# EAGLE schematic main (EAGLE 6.6.0)
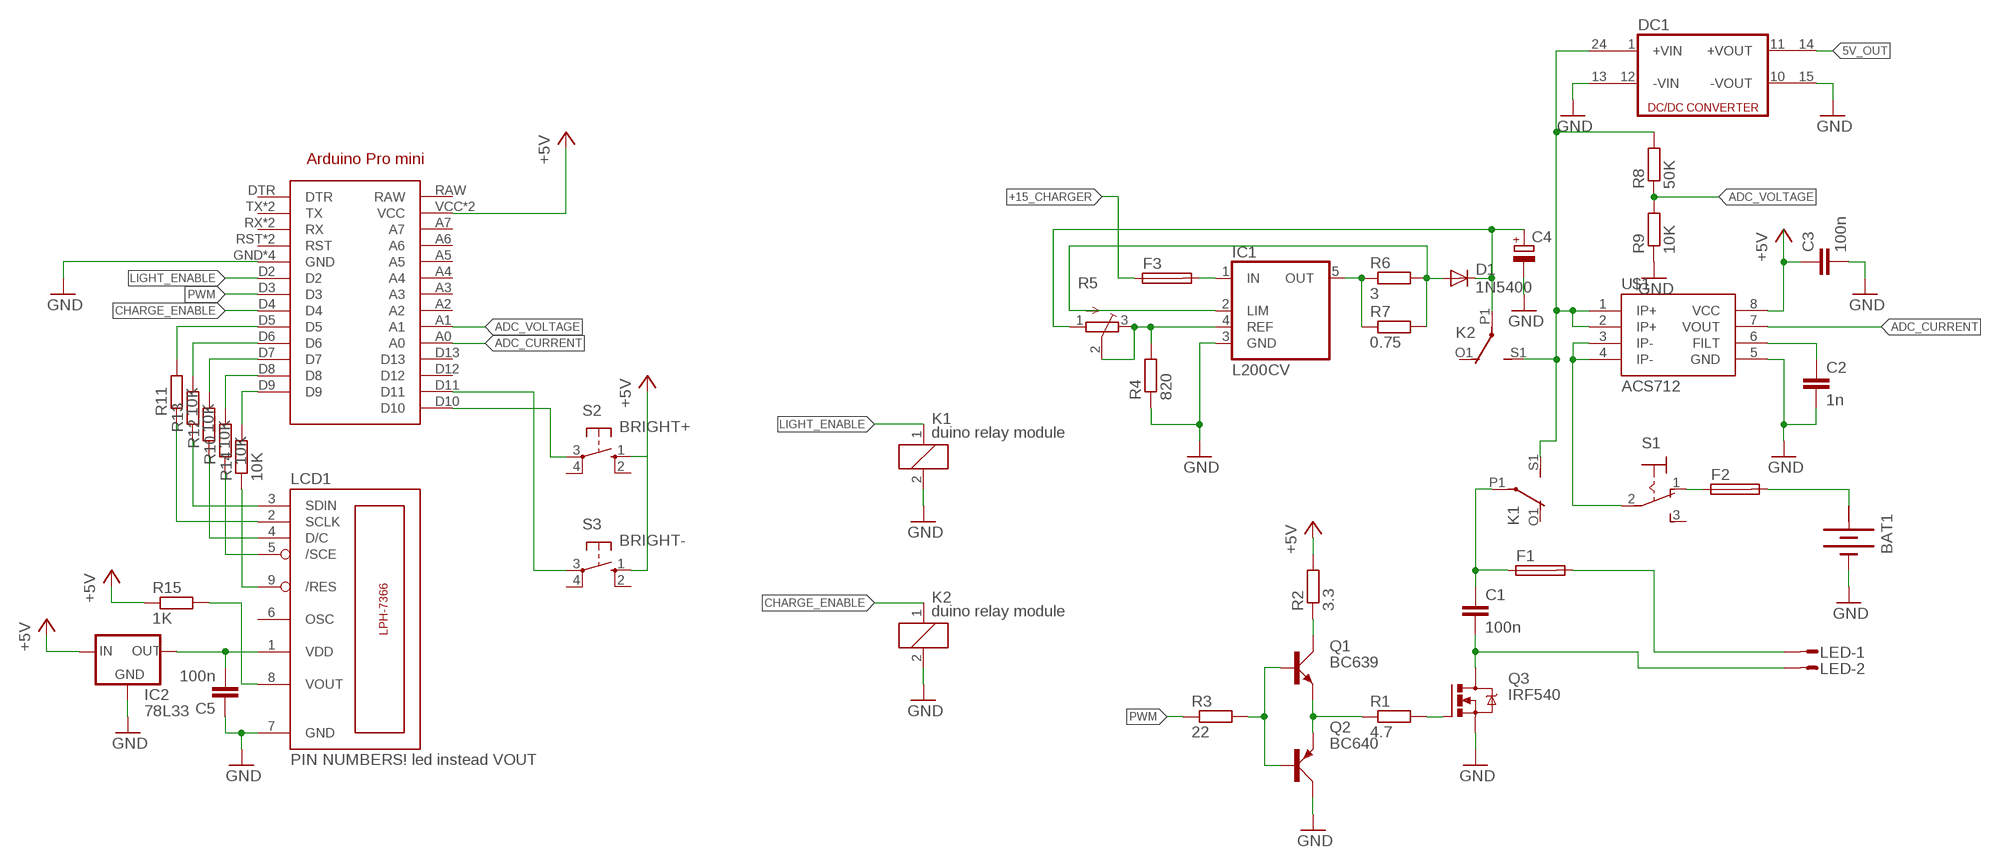
[diagram p0: schematic, sheet 1]

## Parts
ARDUINO1  ARDUINO_PRO_MINI  [ARDUINO_PRO_MINI]
BAT1  BATTERY  [BATTERY]
C1  100n  C2,5-3  [C2.5-3]
C2  1n  C2,5-3  [C2.5-3]
C3  100n  C2,5-3  [C2.5-3]
C4  CPOL-EUE1.8-4  [E1,8-4]
C5  100n  C2,5-3  [C2.5-3]
D1  1N5400  [DO201-15]
DC1  DC213R  [CMK]
F1  FUSESH22,5  [SH22,5]
F2  FUSESH22,5  [SH22,5]
F3  FUSESH22,5  [SH22,5]
IC1  L200CV  L200  [L200S]
IC2  78L33  78LXX  [78LXX]
K1  duino relay module  4052  [F4052]
K2  duino relay module  4052  [F4052]
LCD1  PIN NUMBERS! led instead VOUT  LPH-7366  [LPH-7366]
LED  L02P  [L02P]
Q1  BC639  [SOT54D]
Q2  BC640  [SOT54D]
Q3  IRF540  [TO220BV]
R1  4.7  R-EU_0204/7  [0204/7]
R2  3.3  R-EU_0204/7  [0204/7]
R3  22  R-EU_0204/7  [0204/7]
R4  820  R-EU_0204/7  [0204/7]
R5  TRIM_EU-3223G  [3223G]
R6  3  R-EU_0204/7  [0204/7]
R7  0.75  R-EU_0204/7  [0204/7]
R8  50K  R-EU_0204/7  [0204/7]
R9  10K  R-EU_0204/7  [0204/7]
R10  10K  R-EU_0204/7  [0204/7]
R11  10K  R-EU_0204/7  [0204/7]
R12  10K  R-EU_0204/7  [0204/7]
R13  10K  R-EU_0204/7  [0204/7]
R14  10K  R-EU_0204/7  [0204/7]
R15  1K  R-EU_0204/7  [0204/7]
S1  M9040P  [M9040P]
S2  BRIGHT+  10-XX  [B3F-10XX]
S3  BRIGHT-  10-XX  [B3F-10XX]
U$1  ACS712  [SO08]

## Nets
+5V: ARDUINO1.VCC ARDUINO1.VCC@1(VCC) C3.1 IC2.IN R2.2 R15.1 S2.1(S) S3.1(S) U$1.8(VCC)
+15_CHARGER: F3.1
ADC_CURRENT: U$1.7(VOUT)
ADC_VOLTAGE: R8.1 R9.2
CHARGE_ENABLE: K2.1
GND: ARDUINO1.GND ARDUINO1.GND@1(GND) ARDUINO1.GND@2(GND) ARDUINO1.GND@3(GND) BAT1.- C2.2 C3.2 C4.- C5.1 DC1.13(-VIN1) DC1.15(-VOUT1) IC1.3(GND) IC2.GND K1.2 K2.2 LCD1.7(GND) Q2.C Q3.S R4.1 R9.1 U$1.5(GND)
LIGHT_ENABLE: K1.1
N$1: Q1.E Q2.E R1.1
N$2: Q3.G R1.2
N$3: C1.1 F1.1 K1.P1(2:P)
N$4: S1.2(P) U$1.3(IP-) U$1.4(IP-)
N$5: C1.2 LED.2 Q3.D
N$6: BAT1.+ F2.2
N$7: F1.2 LED.1
N$8: Q1.C R2.1
N$9: Q1.B Q2.B R3.2
N$10: DC1.24(+VIN1) K1.S1(2:S) K2.S1(2:S) R8.2 U$1.1(IP+) U$1.2(IP+)
N$11: C2.1 U$1.6(FILT)
N$12: F2.1 S1.1(O)
N$13: C4.+ D1.C K2.P1(2:P) R5.1(A)
N$14: ARDUINO1.D5 R11.2
N$15: LCD1.2(SCLK) R11.1
N$16: D1.A IC1.2(LIM) R6.2 R7.2
N$17: IC1.4(REF) R4.2 R5.2(S) R5.3(E)
N$18: IC1.5(OUT) R6.1 R7.1
N$19: ARDUINO1.A0
N$20: ARDUINO1.A1
N$21: ARDUINO1.D3
N$22: ARDUINO1.D2
N$23: ARDUINO1.D4
N$24: LCD1.3(SDIN) R13.1
N$25: LCD1.9(/RES) R14.1
N$26: ARDUINO1.D10 S2.3(P)
N$27: C5.2 IC2.OUT LCD1.1(VDD)
N$28: ARDUINO1.D6 R13.2
N$29: ARDUINO1.D9 R14.2
N$30: ARDUINO1.D7 R12.2
N$31: LCD1.4(D/C) R12.1
N$32: ARDUINO1.D8 R10.2
N$33: LCD1.5(/SCE) R10.1
N$34: LCD1.8(VOUT) R15.2
N$35: ARDUINO1.D11 S3.3(P)
N$36: F3.2 IC1.1(IN)
PWM: R3.1
Unconnected: ARDUINO1.A2 ARDUINO1.A3 ARDUINO1.A4 ARDUINO1.A5 ARDUINO1.A6 ARDUINO1.A7 ARDUINO1.D12 ARDUINO1.D13 ARDUINO1.DTR ARDUINO1.RAW ARDUINO1.RST ARDUINO1.RST@1(RST) ARDUINO1.RX ARDUINO1.RX@1(RX) ARDUINO1.TX ARDUINO1.TX@1(TX) DC1.1(+VIN) DC1.10(-VOUT) DC1.11(+VOUT) DC1.12(-VIN) DC1.14(+VOUT1) K1.O1(2:O) K1.O2(3:O) K1.P2(3:P) K1.S2(3:S) K2.O1(2:O) K2.O2(3:O) K2.P2(3:P) K2.S2(3:S) LCD1.6(OSC) S1.3(S) S2.2(S1) S2.4(P1) S3.2(S1) S3.4(P1)

## Power pins joined to a net without a drawn wire
+: BAT1.+@1(+)

## Library data of the parts
ARDUINO1 = arduinopromini:ARDUINO_PRO_MINI: For creating Arduino Pro Mini shields
BAT1 = special:BATTERY: BATTERY
C1-C3 C5 = capacitor-wima:C: CAPACITOR naming: grid - package width
C4 = rcl:CPOL-EU: POLARIZED CAPACITOR, European symbol
D1 = diode:1N5400: DIODE standard rectifier, 3 A, 50 V (Motorola)
DC1 = dc-dc-converter:DC213R: DC-DC CONVERTER; OC_FARNELL: unknown; OC_NEWARK: unknown
F1-F3 = fuse:FUSE: Fuse; OC_FARNELL: unknown; OC_NEWARK: unknown
IC1 = v-reg:L200: VOLTAGE REGULATOR
IC2 = v-reg:78LXX: VOLTAGE REGULATOR
K1 K2 = relay:4052: RELAY 2 x switch, Finder; OC_FARNELL: unknown; OC_NEWARK: unknown
LCD1 = lph-7366:LPH-7366
LED = con-amp-mt:L02P: AMP MT CONNECTOR; OC_FARNELL: unknown; OC_NEWARK: unknown
Q1 = transistor-small-signal:BC639: NPN TRANSISTOR
Q2 = transistor-small-signal:BC640: PNP TRANSISTOR
Q3 = transistor-power:IRF540: HEXFET Power MOSFET
R1-R4 R6-R15 = resistor:R-EU_: RESISTOR, European symbol
R5 = pot:TRIM_EU-: POTENTIOMETER
S1 = switch:M9040P: TOGGLE SWITCH Marquardt
S2 S3 = switch-omron:10-XX: OMRON SWITCH; MPN: B3F-1000; OC_FARNELL: 176432; OC_NEWARK: 36M3542
U$1 = SparkFun:ACS712